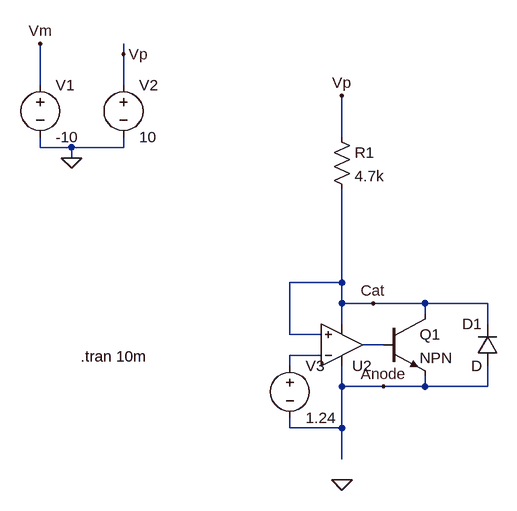
[diagram p0: schematic TL431_ersatz.asc]
TL431_ersatz.asc, the LTspice schematic file:
Version 4
SHEET 1 880 680
WIRE -192 -240 -192 -256
WIRE -320 -192 -320 -256
WIRE -192 -192 -192 -240
WIRE 144 -112 144 -176
WIRE -320 -96 -320 -112
WIRE -272 -96 -320 -96
WIRE -192 -96 -192 -112
WIRE -192 -96 -272 -96
WIRE -272 -80 -272 -96
WIRE 144 112 144 -32
WIRE 144 112 64 112
WIRE 144 144 144 112
WIRE 192 144 144 144
WIRE 272 144 192 144
WIRE 368 144 272 144
WIRE 272 160 272 144
WIRE 144 176 144 144
WIRE 368 176 368 144
WIRE 64 192 64 112
WIRE 112 192 64 192
WIRE 208 208 176 208
WIRE 112 224 64 224
WIRE 64 240 64 224
WIRE 144 272 144 240
WIRE 208 272 144 272
WIRE 272 272 272 256
WIRE 272 272 208 272
WIRE 368 272 368 240
WIRE 368 272 272 272
WIRE 64 336 64 320
WIRE 144 336 144 272
WIRE 144 336 64 336
WIRE 144 384 144 336
FLAG -272 -80 0
FLAG -320 -256 Vm
FLAG -192 -240 Vp
FLAG 192 144 Cat
FLAG 208 272 Anode
FLAG 144 416 0
FLAG 144 -176 Vp
SYMBOL voltage -320 -208 R0
WINDOW 123 0 0 Left 2
WINDOW 39 0 0 Left 2
SYMATTR InstName V1
SYMATTR Value -10
SYMBOL voltage -192 -208 R0
WINDOW 123 0 0 Left 2
WINDOW 39 0 0 Left 2
SYMATTR InstName V2
SYMATTR Value 10
SYMBOL Opamps\\UniversalOpamp2 144 208 M180
SYMATTR InstName U2
SYMBOL voltage 64 224 R0
WINDOW 123 0 0 Left 2
WINDOW 39 0 0 Left 2
SYMATTR InstName V3
SYMATTR Value 1.24
SYMBOL npn 208 160 R0
SYMATTR InstName Q1
SYMBOL diode 384 240 R180
WINDOW 0 24 64 Left 2
WINDOW 3 24 0 Left 2
SYMATTR InstName D1
SYMBOL res 128 -128 R0
SYMATTR InstName R1
SYMATTR Value 4.7k
TEXT -258 226 Left 2 !.tran 10m

The netlist it stands for:
* TL431_ersatz.asc
V1 Vm 0 -10
V2 Vp 0 10
XU2 Cat N002 Anode Cat N001 level.2 Avol=1Meg GBW=10Meg Slew=10Meg ilimit=25m rail=0 Vos=0 phimargin=45 en=0 enk=0 in=0 ink=0 Rin=500Meg  ; pins IN+ IN- V+ V- OUT
V3 N002 Anode 1.24
Q1 Cat N001 Anode 0 NPN
D1 Anode Cat D
R1 Vp Cat 4.7k
.model D D
.lib standard.dio
.model NPN NPN
.model PNP PNP
.lib standard.bjt
.tran 10m
.lib UniversalOpamps2.sub
.backanno
.end